# Altium schematic sheet Flash.SchDoc
size A4; SheetNumber: 5; SheetTotal: 9
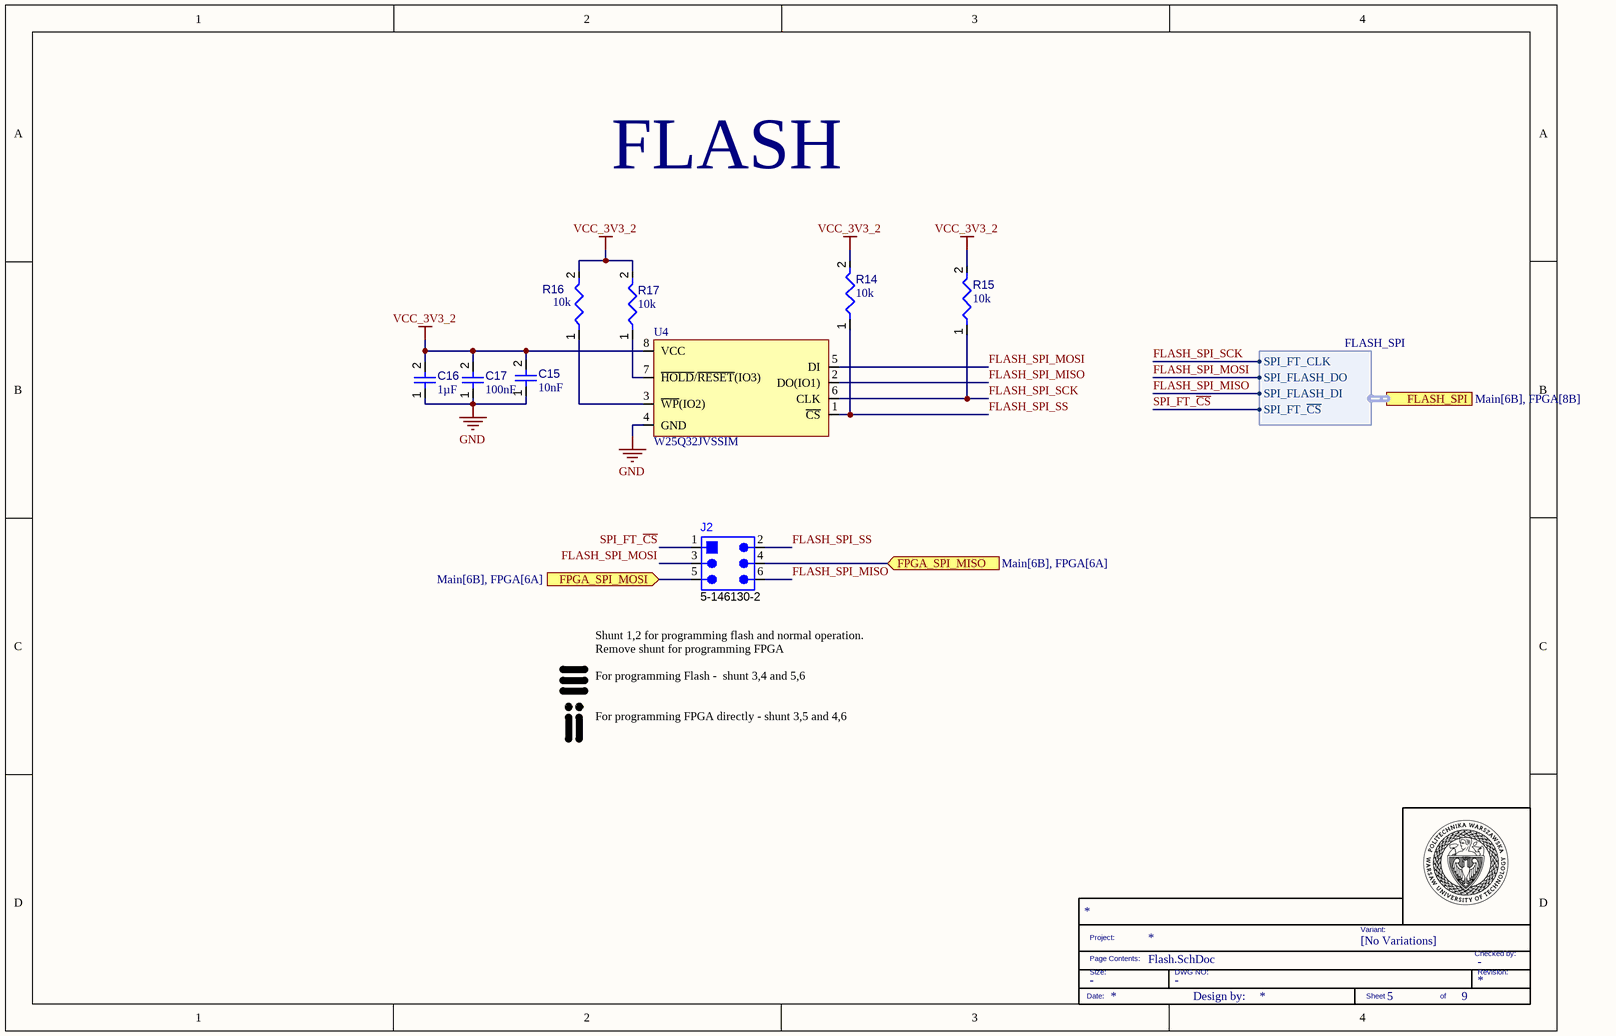
[diagram p0: Flash.SchDoc]

## Parts
*  TITLE_BLOCK  (value not drawn)  (graphical)
C15  value 10nF  [CAPC1608X90X35LL10T15]  (hidden comment: GCM188R71H103KA37J)
C16  value 1µF  [FP-CL10-IPC_C]  (hidden comment: CL10B105KA8NFNC)
C17  value 100nF  [FP-C0603C-CF-IPC_C]  (hidden comment: C0603C104K5RAC7411)
J2  5-146130-2  [TECO-5-146130-2_V]
R14  value 10k  [RESC1608X05N]  (hidden comment: CRCW060310K0FKTC)
R15  value 10k  [RESC1608X05N]  (hidden comment: CRCW060310K0FKTC)
R16  value 10k  [RESC1608X05N]  (hidden comment: CRCW060310K0FKTC)
R17  value 10k  [RESC1608X05N]  (hidden comment: CRCW060310K0FKTC)
U4  W25Q32JVSSIM  [SOIC127P790X175-8N]

## Ports
FLASH_SPI (harness FLASH_SPI, see Main[6B], FPGA[8B]), FPGA_SPI_MISO (in, see Main[6B], FPGA[6A]), FPGA_SPI_MOSI (in, see Main[6B], FPGA[6A])

## Harnesses
FLASH_SPI: SPI_FT_CLK, SPI_FLASH_DO, SPI_FLASH_DI, SPI_FT_~{CS}

## Nets
GND: C15.1 C16.1 C17.1 U4.4(GND)
VCC_3V3_2: C15.2 C16.2 C17.2 R14.2 R15.2 R16.2 R17.2 U4.8(VCC)
FLASH_SPI_MISO: J2.6 U4.2(DO(IO1)) ; port FLASH_SPI.SPI_FLASH_DI
FLASH_SPI_MOSI: J2.3 U4.5(DI) ; port FLASH_SPI.SPI_FLASH_DO
FLASH_SPI_SCK: R15.1 U4.6(CLK) ; port FLASH_SPI.SPI_FT_CLK
FLASH_SPI_SS: J2.2 R14.1 U4.1(~{CS})
FPGA_SPI_MISO: J2.4 ; port FPGA_SPI_MISO
FPGA_SPI_MOSI: J2.5 ; port FPGA_SPI_MOSI
SPI_FT_~{CS}: J2.1 ; port FLASH_SPI.SPI_FT_~{CS}
NetR16_1: R16.1 U4.3(~{WP}(IO2))
NetR17_1: R17.1 U4.7(~{HOLD}/~{RESET}(IO3))

## Notes on the sheet
- FLASH
- (near J2) Shunt 1,2 for programming flash and normal operation. Remove shunt for programming FPGA
  For programming Flash -  shunt 3,4 and 5,6
  For programming FPGA directly - shunt 3,5 and 4,6
- (in symbol CMP-003-000005-7) Variant:; Project:; [No Variations]; Checked by:; Page Contents:; Size:; DWG NO:; Revision:; Date:; Design by:; Sheet; of

## Library data of the parts
* = CMP-003-000005-7: TITLEBLOCK; DWG NO: -; Size: -; Checked by: -; Design Item ID: TITLE_BLOCK; Source: TITLEBLOCK.SchLib
C15 = CMP-001-00231-2: Ceramic Capacitor, Multilayer, Ceramic, 50V, 10% +Tol, 10% -Tol, X7R, 15% TC, 0.01uF, Surface Mount, 0603; Min Operating Temperature: -55°C; Voltage Rating: 50V; Max Operating Temperature: 125°C; Tolerance: 10%; Capacitor Type: Ceramic; Mounting Technology: Surface Mount; RoHS Compliant: Yes; Case/Package: 0603; Pins: 2
C16 = CMP-001-00085-5: Ceramic Capacitor, Multilayer, Ceramic, 25V, 10% +Tol, 10% -Tol, X7R, 15% TC, 1uF, Surface Mount, 0603; Max Operating Temperature: 125°C; Pins: 2; RoHS Compliant: Yes; Min Operating Temperature: -55°C; Capacitor Type: Ceramic; Mounting Technology: Surface Mount; Case/Package: 0603
C17 = CMP-001-00086-8: Ceramic Capacitor, Multilayer, Ceramic, 50V, 10% +Tol, 10% -Tol, X7R, 15% TC, 0.1uF, Surface Mount, 0603; Capacitor Type: Ceramic; Max Operating Temperature: 125°C; Case/Package: 0603; Pins: 2; Min Operating Temperature: -55°C; RoHS Compliant: Yes; Mounting Technology: Surface Mount
J2 = CMP-002-00018-3: Male Header, Pitch 2.54 mm, 2 x 3 Position, Height 8.13 mm, -65 to 125 degC, RoHS, Tube; Manufacturer: TE Connectivity; Datasheet Version: Oct-15; RoHS Compliant: Unknown; Min Operating Temperature: -65°C; Max Operating Temperature: 125°C; Datasheet URL: http://www.te.com/commerce/DocumentDelivery/DDEController?Action=showdoc&DocId=Customer+Drawing%7F146130%7FM%7Fpdf%7FEnglish%7FENG_CD_146130_M.pdf%7F5-146130-2; Package Reference: 5-146130-2; Manufacturer URL: http://www.te.com/; Mounting Technology: SM; Package Description: Male Header, Pitch 2.54 mm, 2 x 3 Position, Height 8.13 mm; Connector Type: Header; Case/Package: 5-146130-2; Gender: Male
R14-R17 = CMP-009-00187-2: Fixed Resistor, Metal Glaze/thick Film, 0.1W, 10000ohm, 75V, 1% +/-Tol, 100ppm/Cel, Surface Mount, 0603; Power: 100mW; Voltage Rating: 75V; Case/Package: 0603; Tolerance: 1%; Min Operating Temperature: -55°C; Mounting Technology: Surface Mount; Max Operating Temperature: 155°C; RoHS Compliant: No; Pins: 2
U4 = CMP-019-00049-1: Flash, 4MX8, PDSO8; Memory Size: 4194304; Max Supply Voltage: 3.6V; Min Supply Voltage: 2.7V; Clock Frequency: 133MHz; RoHS Compliant: Yes; Memory Format: FLASH; Pins: 8; Max Operating Temperature: 85°C; Case/Package: SOP; Min Operating Temperature: -40°C